# Altium schematic sheet LSM6DS3.SchDoc: =GlobalProjectName
size A4; ApprovedBy: Утвердил; CheckedBy: Проверил; Author: Разработал; SheetNumber: 4; SheetTotal: 10; PageSetup: Record=PageOptions|CenterHorizontal=True|CenterVertical=True|PrintScale=1.00|XCorrection=1.00|YCorrection=1.00|PrintKind=1|BorderSize=5000000|LeftOffset=0|BottomOffset=0|Orientation=2|PaperLength=1000|PaperWidth=1000|Scale=100|PaperSource=15|PrintQuality=1200|MediaType=1|DitherType=10|PaperKind=A3|PrintScaleMode=1; Weight: -; ScaleFactor: -; NormInspection: Норм.Контр.
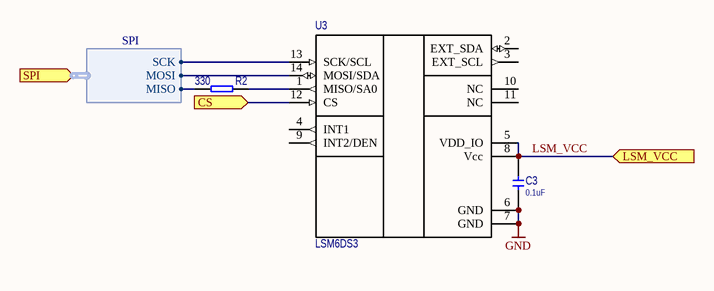
[diagram p0: LSM6DS3.SchDoc]

## Parts
C3  value 0.1uF  [CERCAP 0402]
R2  value 330  [RES 0402]
U3  LSM6DS3  [LGA14_LSM6DS3]

## Ports
CS (in), LSM_VCC (in), SPI (in, harness SPI)

## Harnesses
SPI: SCK, MOSI, MISO

## Nets
GND: C3.1 U3.6(GND) U3.7(GND)
CS: U3.12(CS) ; port CS
LSM_VCC: C3.2 U3.5(VDD_IO) U3.8(Vcc) ; port LSM_VCC
NetR2_1: R2.1 ; port SPI.MISO
NetR2_2: R2.2 U3.1(MISO/SA0)
NetU3_13: U3.13(SCK/SCL) ; port SPI.SCK
NetU3_14: U3.14(MOSI/SDA) ; port SPI.MOSI

Not connected (* = marked no-connect by the designer): U3 2(EXT_SDA) 3(EXT_SCL) 4(INT1) 9(INT2/DEN) 10(NC) 11(NC)

## Notes on the sheet
- Title
- Size:
- Date:
- A4
- Number:
- Time:
- Revision:
- Sheet
- of
- File:

## Library data of the parts
C3 = !Capacitor: Capacitor; IsSMT: NoSMT; Diel: X7R; Voltage: *
R2 = !Resistor: Resistor; IsSMT: NoSMT
U3 = LSM6DS3: Acc/Gyro; IsSMT: NoSMT